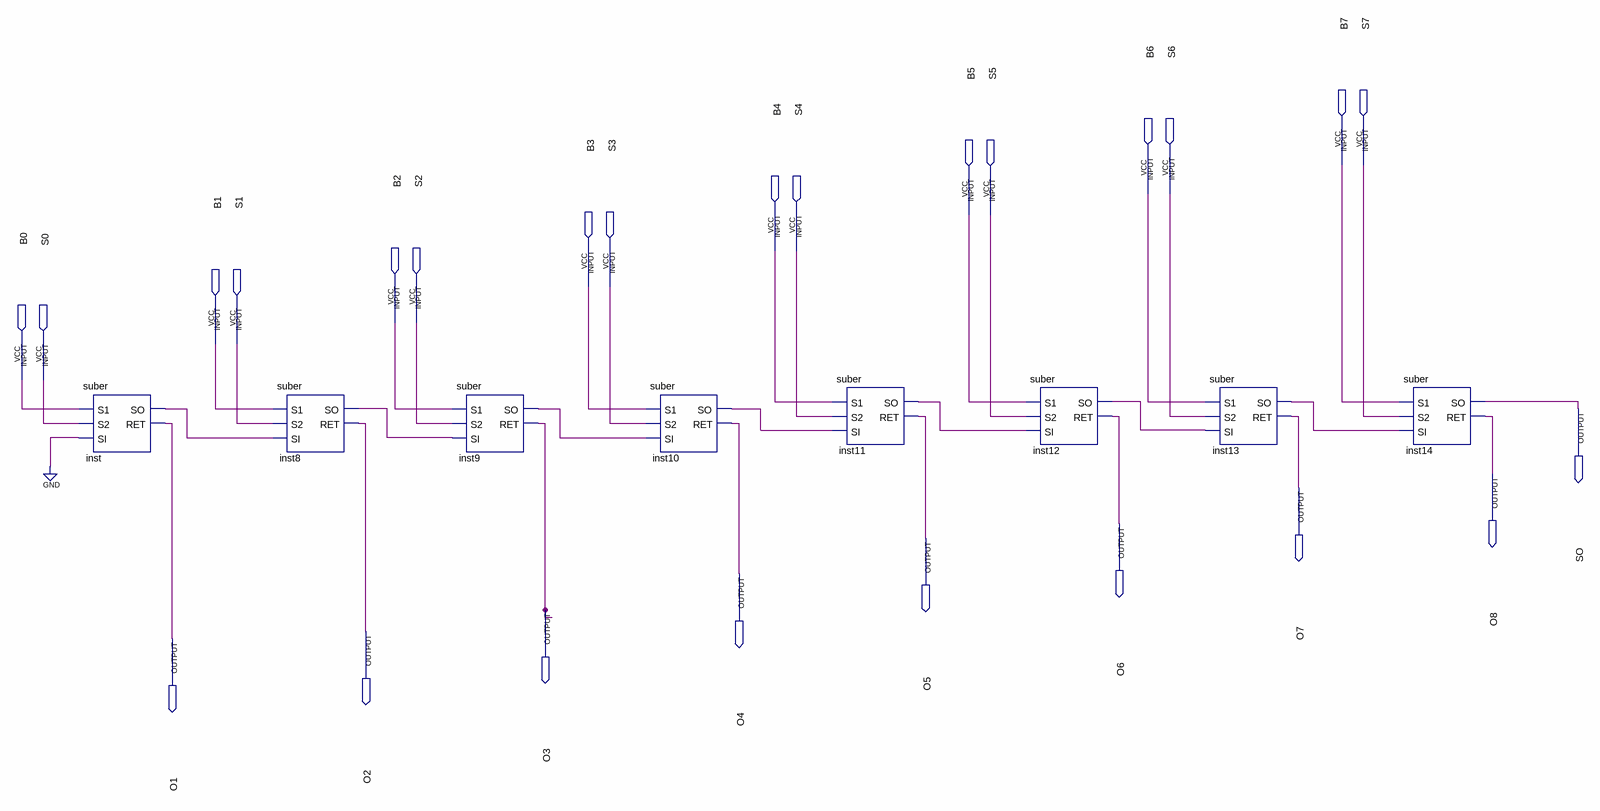
[diagram p0: schematic sheet]
// Quartus schematic suber_8.bdf as structural Verilog: 8 symbols, 25 pins
module suber_8 (
  input  B7,
  input  S7,
  input  B6,
  input  S6,
  input  B5,
  input  S5,
  input  B4,
  input  S4,
  input  B3,
  input  S3,
  input  B2,
  input  S2,
  input  B1,
  input  S1,
  input  B0,
  input  S0,
  output SO,
  output O8,
  output O7,
  output O6,
  output O5,
  output O4,
  output O3,
  output O2,
  output O1
);

  wire inst8_so, inst9_so, inst10_so, inst11_so, inst12_so, inst13_so, inst_so;

  suber inst (.S1(B0), .S2(S0), .SI(1'b0), .SO(inst_so), .RET(O1));
  suber inst8 (.S1(B1), .S2(S1), .SI(inst_so), .SO(inst8_so), .RET(O2));
  suber inst9 (.S1(B2), .S2(S2), .SI(inst8_so), .SO(inst9_so), .RET(O3));
  suber inst10 (.S1(B3), .S2(S3), .SI(inst9_so), .SO(inst10_so), .RET(O4));
  suber inst11 (.S1(B4), .S2(S4), .SI(inst10_so), .SO(inst11_so), .RET(O5));
  suber inst12 (.S1(B5), .S2(S5), .SI(inst11_so), .SO(inst12_so), .RET(O6));
  suber inst13 (.S1(B6), .S2(S6), .SI(inst12_so), .SO(inst13_so), .RET(O7));
  suber inst14 (.S1(B7), .S2(S7), .SI(inst13_so), .SO(SO), .RET(O8));
endmodule
